# Altium schematic sheet [1] ESP32-S3.SchDoc: ESP32-S3
size OrCAD B; DocumentNumber: 01; Revision: 01; SheetNumber: 01
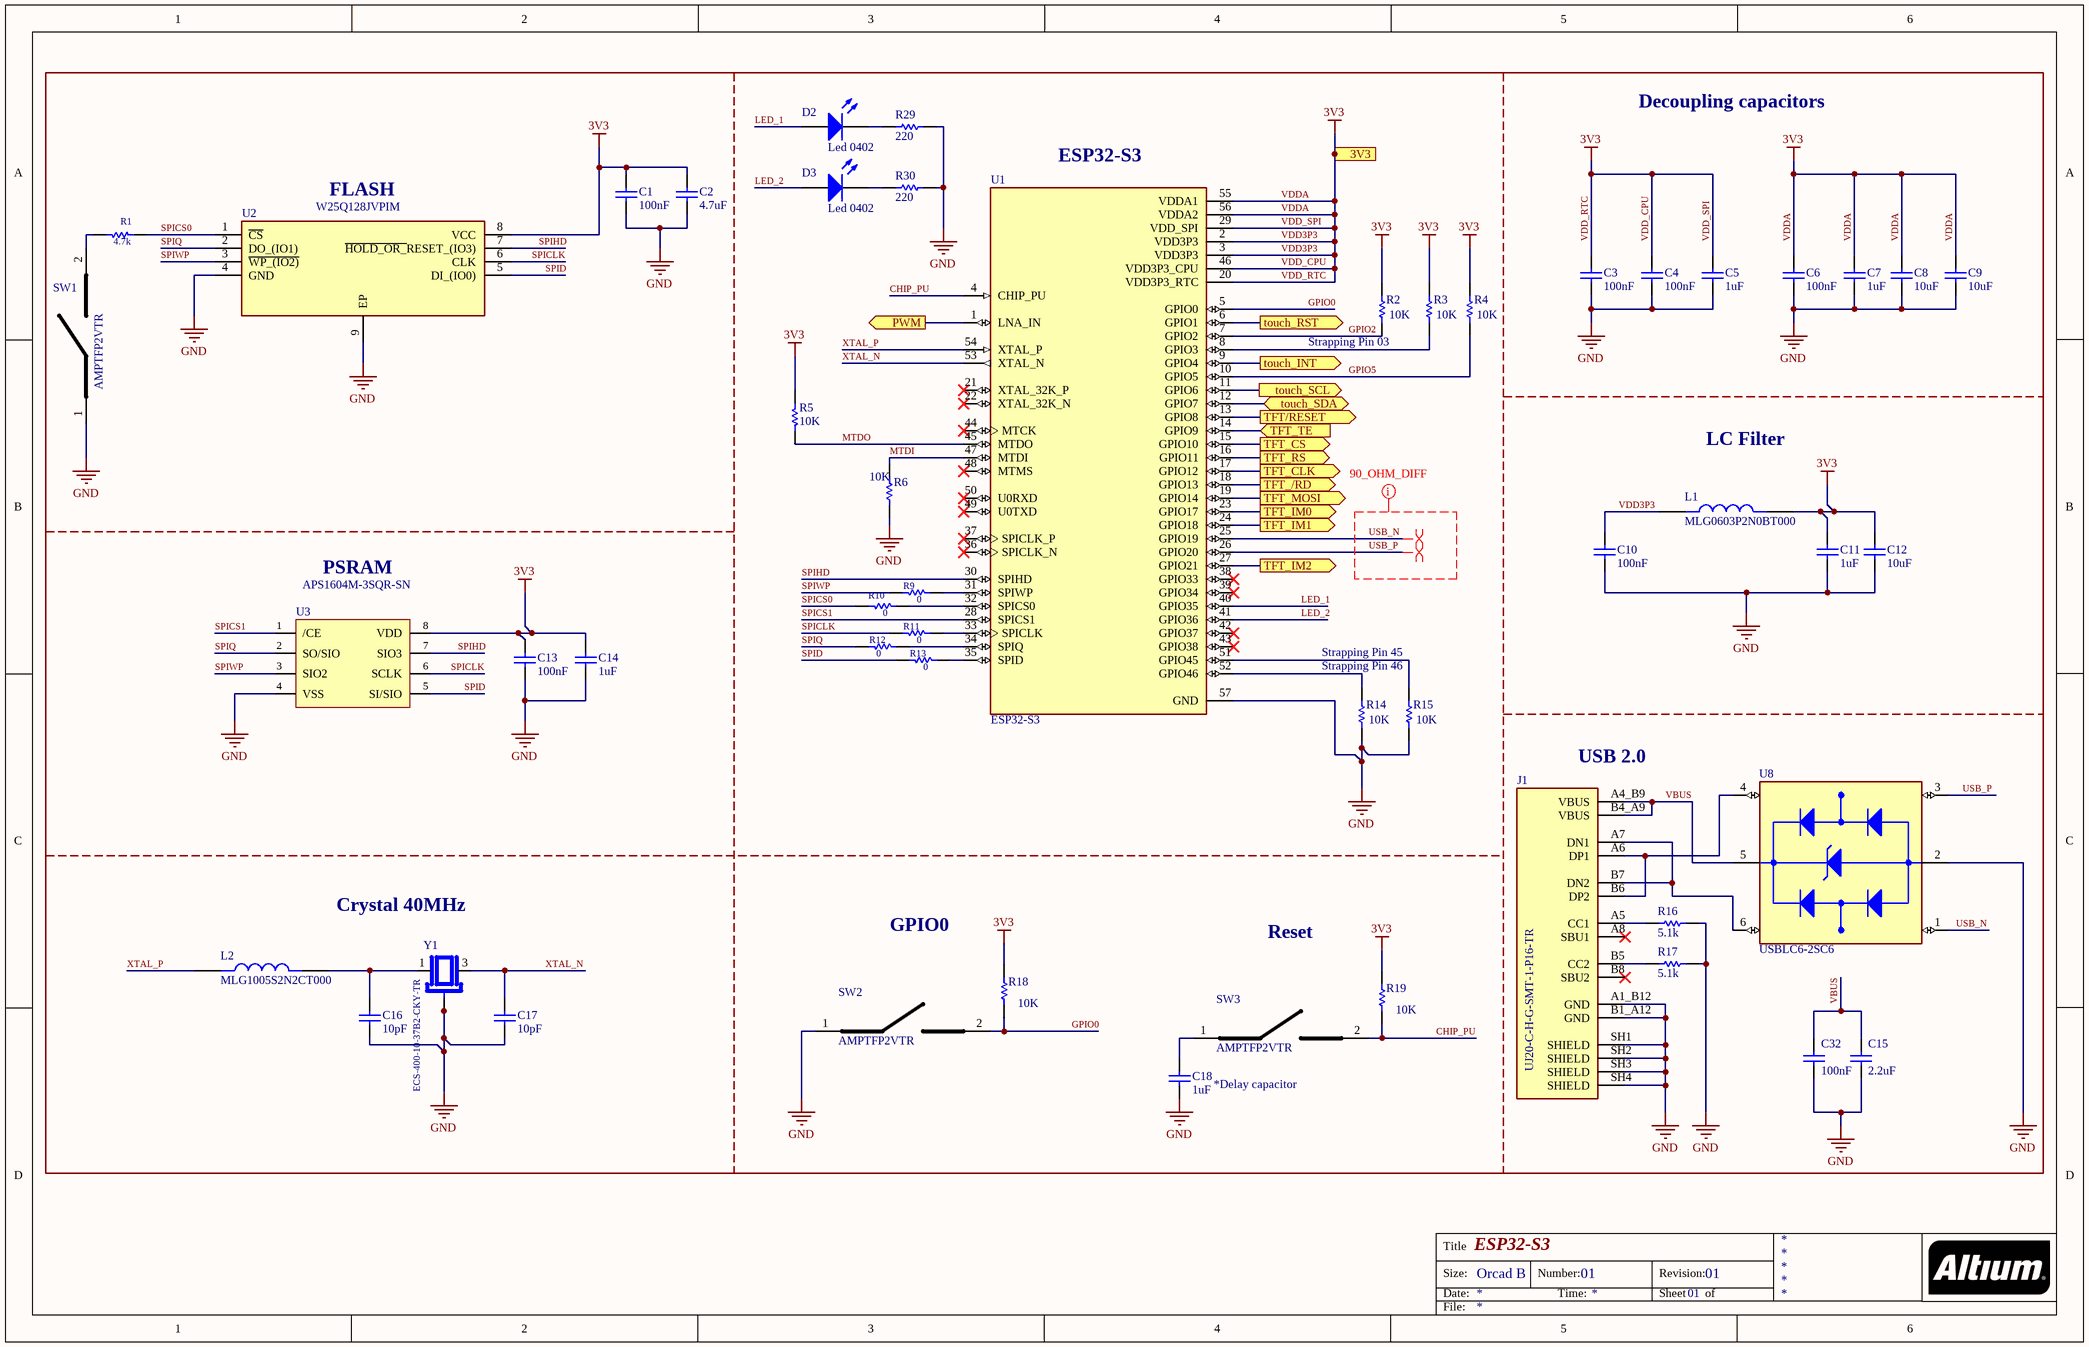
[diagram p0: [1] ESP32-S3.SchDoc]

## Parts
C1  100nF  [Capacitor 0402]
C2  4.7uF  [Capacitor 0402]
C3  100nF  [Capacitor 0402]
C4  100nF  [Capacitor 0402]
C5  1uF  [Capacitor 0402]
C6  100nF  [Capacitor 0402]
C7  1uF  [Capacitor 0402]
C8  10uF  [Capacitor 0603]
C9  10uF  [Capacitor 0603]
C10  100nF  [Capacitor 0402]
C11  1uF  [Capacitor 0402]
C12  10uF  [Capacitor 0603]
C13  100nF  [Capacitor 0402]
C14  1uF  [Capacitor 0402]
C15  2.2uF  [Capacitor 0402]
C16  10pF  [Capacitor 0402]
C17  10pF  [Capacitor 0402]
C18  1uF  [Capacitor 0402]
C32  100nF  [Capacitor 0402]
D2  Led 0402  [LED 0402]
D3  Led 0402  [LED 0402]
J1  UJ20-C-H-G-SMT-1-P16-TR  [SAMESKY_UJ20-C-H-G-SMT-1-P16-TR]
L1  MLG0603P2N0BT000  [INDC0603X33N]
L2  MLG1005S2N2CT000  [INDC1005X55N]
R1  4.7k  [Resistencia 0402]
R2  10K  [Resistencia 0402]
R3  10K  [Resistencia 0402]
R4  10K  [Resistencia 0402]
R5  10K  [Resistencia 0402]
R6  10K  [Resistencia 0402]
R9  0  [Resistencia 0402]
R10  0  [Resistencia 0402]
R11  0  [Resistencia 0402]
R12  0  [Resistencia 0402]
R13  0  [Resistencia 0402]
R14  10K  [Resistencia 0402]
R15  10K  [Resistencia 0402]
R16  5.1k  [Resistencia 0402]
R17  5.1k  [Resistencia 0402]
R18  10K  [Resistencia 0402]
R19  10K  [Resistencia 0402]
R29  220  [Resistencia 0402]
R30  220  [Resistencia 0402]
SW1  AMPTFP2VTR  [AMPTFP2VTR]
SW2  AMPTFP2VTR  [AMPTFP2VTR]
SW3  AMPTFP2VTR  [AMPTFP2VTR]
U1  ESP32-S3  [IC_ESP32-S3]
U2  W25Q128JVPIM  [SON127P600X500X80-9N-D]
U3  APS1604M-3SQR-SN  [SOIC127P600X165-8N]
U8  USBLC6-2SC6  [SOT95P280X145-6N]
Y1  ECS-400-10-37B2-CKY-TR  [XTAL_ECS-400-10-37B2-CKY-TR]

## Ports
3V3, PWM (out), TFT/RESET (out), TFT_/RD (out), TFT_CLK (out), TFT_CS (out), TFT_IM0 (out), TFT_IM1 (out), TFT_IM2 (out), TFT_MOSI (out), TFT_RS (out), TFT_TE (in), touch_INT (out), touch_RST (out), touch_SCL (out), touch_SDA (bidir)

## Nets
GND: C1.1 C2.1 C3.1 C4.1 C5.1 C6.1 C7.1 C8.1 C9.1 C10.1 C11.1 C12.1 C13.1 C14.1 C15.1 C16.1 C17.1 C18.1 C32.1 J1.A1_B12(GND) J1.B1_A12(GND) J1.SH1(SHIELD) J1.SH2(SHIELD) J1.SH3(SHIELD) J1.SH4(SHIELD) R6.1(A) R14.1(A) R15.1(A) R16.1(A) R17.1(A) R29.2(B) R30.2(B) SW1.1(COM) SW2.1(COM) U1.57(GND) U2.4(GND) U2.9(EP) U3.4(VSS) U8.2(GND) Y1.2(GND) Y1.4(GND)
VDD3P3: C1.2 C2.2 C3.2 C4.2 C5.2 C6.2 C7.2 C8.2 C9.2 C10.2 C11.2 C12.2 C13.2 C14.2 L1.1 L1.2 R2.2(B) R3.2(B) R4.2(B) R5.2(B) R18.2(B) R19.2(B) U1.2(VDD3P3) U1.3(VDD3P3) U1.20(VDD3P3_RTC) U1.29(VDD_SPI) U1.46(VDD3P3_CPU) U1.55(VDDA1) U1.56(VDDA2) U2.8(VCC) U3.8(VDD) ; port 3V3  [also labelled 3V3, VDD_CPU, VDD_RTC, VDD_SPI, VDDA]
CHIP_PU: R19.1(A) SW3.2(NO) U1.4(CHIP_PU)
GPIO0: R18.1(A) SW2.2(NO) U1.5(GPIO0)
GPIO2: R2.1(A) U1.7(GPIO2)
GPIO5: R4.1(A) U1.10(GPIO5)
LED_1: D2.1(A) U1.40(GPIO35)
LED_2: D3.1(A) U1.41(GPIO36)
MTDI: R6.2(B) U1.47(MTDI)
MTDO: R5.1(A) U1.45(MTDO)
PWM: U1.1(LNA_IN) ; port PWM
SPICLK: R11.2(B) U2.6(CLK) U3.6(SCLK)
SPICS0: R1.1(A) R10.1(A) U2.1(~{CS})
SPICS1: U1.28(SPICS1) U3.1(/CE)
SPID: R13.2(B) U2.5(DI_(IO0)) U3.5(SI/SIO)
SPIHD: U1.30(SPIHD) U2.7(~{HOLD_OR_}RESET_(IO3)) U3.7(SIO3)
SPIQ: R12.2(B) U2.2(DO_(IO1)) U3.2(SO/SIO)
SPIWP: R9.2(B) U2.3(~{WP_(IO2)}) U3.3(SIO2)
TFT/RESET: U1.13(GPIO8) ; port TFT/RESET
TFT_/RD: U1.18(GPIO13) ; port TFT_/RD
TFT_CLK: U1.17(GPIO12) ; port TFT_CLK
TFT_CS: U1.15(GPIO10) ; port TFT_CS
TFT_IM0: U1.23(GPIO17) ; port TFT_IM0
TFT_IM1: U1.24(GPIO18) ; port TFT_IM1
TFT_IM2: U1.27(GPIO21) ; port TFT_IM2
TFT_MOSI: U1.19(GPIO14) ; port TFT_MOSI
TFT_RS: U1.16(GPIO11) ; port TFT_RS
TFT_TE: U1.14(GPIO9) ; port TFT_TE
touch_INT: U1.9(GPIO4) ; port touch_INT
touch_RST: U1.6(GPIO1) ; port touch_RST
touch_SCL: U1.11(GPIO6) ; port touch_SCL
touch_SDA: U1.12(GPIO7) ; port touch_SDA
USB_N: U1.25(GPIO19) U8.1(I/O1_IN)
USB_P: U1.26(GPIO20) U8.3(I/O2_IN)
VBUS: C15.2 C32.2 J1.A4_B9(VBUS) J1.B4_A9(VBUS) U8.5(VBUS)
XTAL_N: C17.2 U1.53(XTAL_N) Y1.3(OUT/IN)
XTAL_P: L2.1 U1.54(XTAL_P)
NetC16_2: C16.2 L2.2 Y1.1(IN/OUT)
NetC18_2: C18.2 SW3.1(COM)
NetD2_2: D2.2(K) R29.1(A)
NetD3_2: D3.2(K) R30.1(A)
NetJ1_A5: J1.A5(CC1) R16.2(B)
NetJ1_A6: J1.A6(DP1) J1.B6(DP2) U8.4(I/O2_OUT)
NetJ1_A7: J1.A7(DN1) J1.B7(DN2) U8.6(I/O1_OUT)
NetJ1_B5: J1.B5(CC2) R17.2(B)
NetR1_2: R1.2(B) SW1.2(NO)
NetR3_1: R3.1(A) U1.8(GPIO3)
NetR9_1: R9.1(A) U1.31(SPIWP)
NetR10_2: R10.2(B) U1.32(SPICS0)
NetR11_1: R11.1(A) U1.33(SPICLK)
NetR12_1: R12.1(A) U1.34(SPIQ)
NetR13_1: R13.1(A) U1.35(SPID)
NetR14_2: R14.2(B) U1.52(GPIO46)
NetR15_2: R15.2(B) U1.51(GPIO45)

Not connected (* = marked no-connect by the designer): J1 A8(SBU1)* B8(SBU2)*; U1 21(XTAL_32K_P)* 22(XTAL_32K_N)* 36(SPICLK_N)* 37(SPICLK_P)* 38(GPIO33)* 39(GPIO34)* 42(GPIO37)* 43(GPIO38)* 44(MTCK)* 48(MTMS)* 49(U0TXD)* 50(U0RXD)*

## Layout directives
differential pair; differential pair class 90_OHM_DIFF: USB_N, USB_P
mark named 90_OHM_DIFF: USB_N, USB_P

## Notes on the sheet
- Decoupling capacitors
- (near U2) FLASH
- (near U1) ESP32-S3
- (near R2) Strapping Pin 03
- LC Filter
- PSRAM
- Strapping Pin 45
- Strapping Pin 46
- (near J1) USB 2.0
- Crystal 40MHz
- GPIO0
- Reset
- *Delay capacitor
- Title
- Size:
- Date:
- Orcad B
- Number:
- Time:
- Revision:
- Sheet
- of
- File:

## Library data of the parts
C1-C7 C10 C11 C13-C18 C32 = Capacitor 0402: Capacitor Ceramico SMD 0402
C8 C9 C12 = Capacitor 0603: Capacitor Ceramico SMD 0603
D2 D3 = LED 0402: LED SMD 0402
J1 = UJ20-C-H-G-SMT-1-P16-TR: USB-C (USB TYPE-C) USB 2.0 Receptacle Connector 24 (16+8 Dummy) Position Surface Mount, Right Angle; Through Hole; MF: Same Sky; SnapEDA_Link: https://www.snapeda.com/parts/UJ20-C-H-G-SMT-1-P16-TR/Same+Sky/view-part/?ref=snap; Package: None; Value: *; MP: UJ20-C-H-G-SMT-1-P16-TR; Check_prices: https://www.snapeda.com/parts/UJ20-C-H-G-SMT-1-P16-TR/Same+Sky/view-part/?ref=eda
L1 = MLG0603P2N0BT000: 2 nH Unshielded Multilayer Inductor 600 mA 100mOhm Max 0201 (0603 Metric); MF: TDK; Price: None; Check_prices: https://www.snapeda.com/parts/MLG0603P2N0BT000/TDK/view-part/?ref=eda; Package: 0603 Taiyo Yuden; Purchase-URL: https://pricing.snapeda.com/search/part/MLG0603P2N0BT000/?ref=eda; SnapEDA_Link: https://www.snapeda.com/parts/MLG0603P2N0BT000/TDK/view-part/?ref=snap; Value: *; MP: MLG0603P2N0BT000; Availability: In Stock
L2 = MLG1005S2N2CT000: FIXED IND 2.2NH 900MA 150MOHM SM; MF: TDK Corporation; SnapEDA_Link: https://www.snapeda.com/parts/MLG1005S2N2CT000/TDK/view-part/?ref=snap; Package: 1005-2 TDK; Value: *; MP: MLG1005S2N2CT000; Check_prices: https://www.snapeda.com/parts/MLG1005S2N2CT000/TDK/view-part/?ref=eda
R1-R6 R9-R19 R29 R30 = Resistencia SMD 0402
SW1-SW3 = AMPTFP2VTR: Tactile Switch SPST-NO Top Actuated Surface Mount; Manufacturer_Name: Apem; Geometry.Height: 2.2mm; Mouser Part Number: 642-AMPTFP2VTR; Mouser Price/Stock: https://www.mouser.co.uk/ProductDetail/Apem/AMPTFP2VTR?qs=%252B9%2Fcbd0IE0SYwG%252BIJFZl2Q%3D%3D; Manufacturer_Part_Number: AMPTFP2VTR; Datasheet Link: https://www.mouser.se/datasheet/2/26/apem_appms00196-1-1733699.pdf
U1 = ESP32-S3: IC RF TxRx + MCU Bluetooth, WiFi 802.11b/g/n, Bluetooth v5.0 2.412GHz ~ 2.484GHz 56-VFQFN Exposed Pad; MF: Espressif Systems; Check_prices: https://www.snapeda.com/parts/ESP32-S3/Espressif+Systems/view-part/?ref=eda; Purchase-URL: https://pricing.snapeda.com/search/part/ESP32-S3/?ref=eda; Value: *; Availability: In Stock; Package: None; SnapEDA_Link: https://www.snapeda.com/parts/ESP32-S3/Espressif+Systems/view-part/?ref=snap; MP: ESP32-S3; Price: None
U2 = W25Q128JVPIM: 128M-bit Serial Flash Memory with uniform 4KB sectors and Dual/Quad SPI; Manufacturer_Name: Winbond; Geometry.Height: 0.8mm; Mouser Part Number: 454-W25Q128JVPIM; Mouser Price/Stock: https://www.mouser.co.uk/ProductDetail/Winbond/W25Q128JVPIM?qs=qSfuJ%252Bfl%2Fd62hi5N%252Bd7%252B%252BA%3D%3D; Manufacturer_Part_Number: W25Q128JVPIM; Datasheet Link: https://www.winbond.com/hq/search-resource-file.jsp?partNo=W25Q128JVPIM&type=datasheet
U3 = APS1604M-3SQR-SN: DRAM IoT RAM 16Mb QSPI (x1,x4) SDR 133/84MHz, RBX, 3V, Ind. Temp., SOP8
U8 = USBLC6-2SC6: 17V Clamp 5A (8/20Âµs) Ipp Tvs Diode Surface Mount SOT-23-6; MF: STMicroelectronics; Value: *; SnapEDA_Link: https://www.snapeda.com/parts/USBLC6-2SC6/STMicroelectronics/view-part/?ref=snap; Check_prices: https://www.snapeda.com/parts/USBLC6-2SC6/STMicroelectronics/view-part/?ref=eda; Purchase-URL: https://pricing.snapeda.com/search/part/USBLC6-2SC6/?ref=eda; Price: None; Availability: In Stock; Package: SOT-23-6 STMicroelectronics; MP: USBLC6-2SC6
Y1 = ECS-400-10-37B2-CKY-TR: Package: None; Price: None; Value: *; MP: ECS-400-10-37B2-CKY-TR; Availability: Unavailable